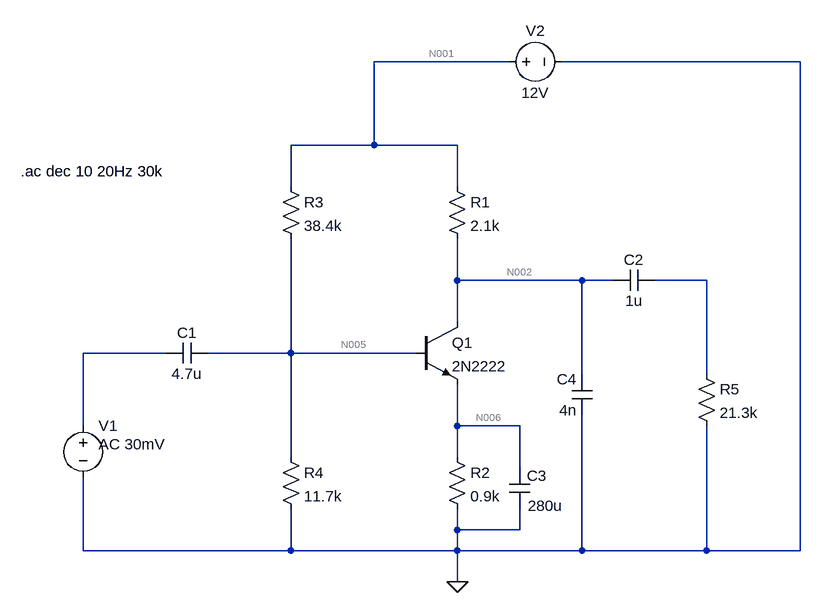
[diagram p0: schematic singlestageamp.asc]
singlestageamp.asc, the LTspice schematic file:
Version 4.1
SHEET 1 880 680
WIRE 272 -288 64 -288
WIRE 720 -288 352 -288
WIRE 64 -160 64 -288
WIRE 64 -160 -64 -160
WIRE 192 -160 64 -160
WIRE -64 -96 -64 -160
WIRE 192 -96 192 -160
WIRE 192 48 192 -16
WIRE 384 48 192 48
WIRE 432 48 384 48
WIRE 576 48 496 48
WIRE 192 112 192 48
WIRE -256 160 -384 160
WIRE -64 160 -64 -16
WIRE -64 160 -192 160
WIRE 128 160 -64 160
WIRE 384 192 384 48
WIRE 576 192 576 48
WIRE -384 272 -384 160
WIRE 192 272 192 208
WIRE 288 272 192 272
WIRE -64 320 -64 160
WIRE 192 320 192 272
WIRE 288 336 288 272
WIRE 192 432 192 400
WIRE 288 432 288 400
WIRE 288 432 192 432
WIRE -384 464 -384 352
WIRE -64 464 -64 400
WIRE -64 464 -384 464
WIRE 192 464 192 432
WIRE 192 464 -64 464
WIRE 384 464 384 256
WIRE 384 464 192 464
WIRE 576 464 576 272
WIRE 576 464 384 464
WIRE 720 464 720 -288
WIRE 720 464 576 464
WIRE 192 512 192 464
FLAG 192 512 0
SYMBOL res 176 -112 R0
SYMATTR InstName R1
SYMATTR Value 2.1k
SYMBOL res 176 304 R0
SYMATTR InstName R2
SYMATTR Value 0.9k
SYMBOL res -80 -112 R0
SYMATTR InstName R3
SYMATTR Value 38.4k
SYMBOL res -80 304 R0
SYMATTR InstName R4
SYMATTR Value 11.7k
SYMBOL cap -192 144 R90
WINDOW 0 0 32 VBottom 2
WINDOW 3 32 32 VTop 2
SYMATTR InstName C1
SYMATTR Value 4.7u
SYMBOL cap 496 32 R90
WINDOW 0 0 32 VBottom 2
WINDOW 3 32 32 VTop 2
SYMATTR InstName C2
SYMATTR Value 1u
SYMBOL cap 304 400 R180
WINDOW 0 -26 51 Left 2
WINDOW 3 -51 5 Left 2
SYMATTR InstName C3
SYMATTR Value 280u
SYMBOL cap 400 256 R180
WINDOW 0 24 56 Left 2
WINDOW 3 24 8 Left 2
SYMATTR InstName C4
SYMATTR Value 4n
SYMBOL res 560 176 R0
SYMATTR InstName R5
SYMATTR Value 21.3k
SYMBOL voltage -384 256 R0
WINDOW 123 24 44 Left 2
WINDOW 39 0 0 Left 0
WINDOW 3 13 118 Left 2
SYMATTR Value2 AC 30mV
SYMATTR Value ""
SYMATTR InstName V1
SYMBOL voltage 256 -288 R270
WINDOW 0 32 56 VTop 2
WINDOW 3 -32 56 VBottom 2
WINDOW 123 0 0 Left 0
WINDOW 39 0 0 Left 0
SYMATTR InstName V2
SYMATTR Value 12V
SYMBOL npn 128 112 R0
SYMATTR InstName Q1
SYMATTR Value 2N2222
TEXT -480 -120 Left 2 !.ac dec 10 20Hz 30k

The netlist it stands for:
* singlestageamp.asc
R1 N001 N002 2.1k
R2 N006 0 0.9k
R3 N001 N005 38.4k
R4 N005 0 11.7k
C1 N005 N004 4.7u
C2 N003 N002 1u
C3 0 N006 280u
C4 0 N002 4n
R5 N003 0 21.3k
V1 N004 0 AC 30mV
V2 N001 0 12V
Q1 N002 N005 N006 0 2N2222
.model NPN NPN
.model PNP PNP
.lib standard.bjt
.ac dec 10 20Hz 30k
.backanno
.end

* Results of the author's LTspice run, read from the files saved beside the schematic
* Operating Point, zero values left out:
*   V(n002) = 7.286 V
*   V(n005) = 2.705 V
*   V(n001) = 12 V
*   V(n006) = 2.03 V
*   I(R3) = 242 µA
*   I(R1) = 2.245 mA
*   I(V2) = -2.487 mA
*   I(R2) = 2.255 mA
*   I(R4) = 231.2 µA
*   Ic(Q1) = 2.245 mA
*   Ib(Q1) = 10.81 µA
*   Ie(Q1) = -2.255 mA